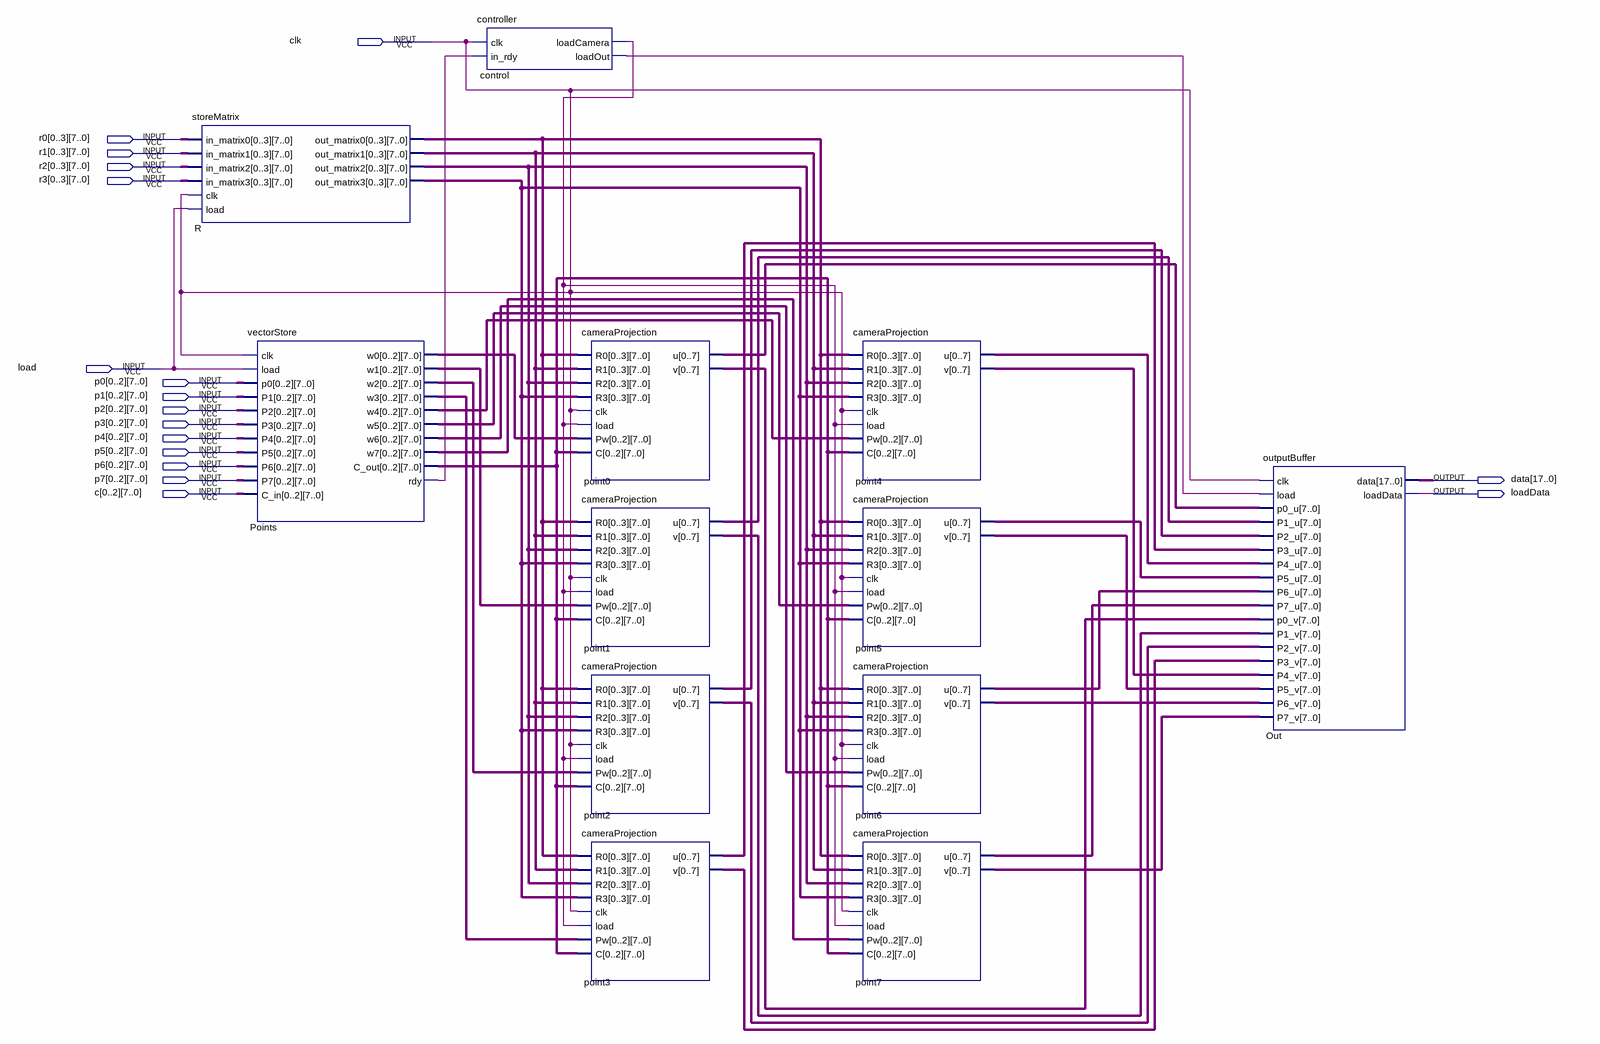
[diagram p0: schematic sheet]
// Quartus schematic projection.bdf as structural Verilog: 12 symbols, 17 pins
module projection (
  input  clk,
  input  [7:0] r0_0,
  input  [7:0] r0_1,
  input  [7:0] r0_2,
  input  [7:0] r0_3,
  input  [7:0] r1_0,
  input  [7:0] r1_1,
  input  [7:0] r1_2,
  input  [7:0] r1_3,
  input  [7:0] r2_0,
  input  [7:0] r2_1,
  input  [7:0] r2_2,
  input  [7:0] r2_3,
  input  [7:0] r3_0,
  input  [7:0] r3_1,
  input  [7:0] r3_2,
  input  [7:0] r3_3,
  input  load,
  input  [7:0] p0_0,
  input  [7:0] p0_1,
  input  [7:0] p0_2,
  input  [7:0] p1_0,
  input  [7:0] p1_1,
  input  [7:0] p1_2,
  input  [7:0] p2_0,
  input  [7:0] p2_1,
  input  [7:0] p2_2,
  input  [7:0] p3_0,
  input  [7:0] p3_1,
  input  [7:0] p3_2,
  input  [7:0] p4_0,
  input  [7:0] p4_1,
  input  [7:0] p4_2,
  input  [7:0] p5_0,
  input  [7:0] p5_1,
  input  [7:0] p5_2,
  input  [7:0] p6_0,
  input  [7:0] p6_1,
  input  [7:0] p6_2,
  input  [7:0] p7_0,
  input  [7:0] p7_1,
  input  [7:0] p7_2,
  input  [7:0] c_0,
  input  [7:0] c_1,
  input  [7:0] c_2,
  output [17:0] data,
  output loadData
);

  wire control_loadcamera, control_loadout, Points_rdy;
  wire [7:0] point0_u, point0_v, point1_u, point1_v, point2_u, point2_v, point3_u, point3_v, point4_u,
       point4_v, point5_u, point5_v, point6_u, point6_v, point7_u, point7_v;
  wire [23:0] Points_c_out, Points_w0, Points_w1, Points_w2, Points_w3, Points_w4, Points_w5, Points_w6,
       Points_w7;
  wire [31:0] R_out_matrix0, R_out_matrix1, R_out_matrix2, R_out_matrix3;

  storeMatrix R (
    .in_matrix0({r0_0, r0_1, r0_2, r0_3}), .in_matrix1({r1_0, r1_1, r1_2, r1_3}),
    .in_matrix2({r2_0, r2_1, r2_2, r2_3}), .in_matrix3({r3_0, r3_1, r3_2, r3_3}), .clk(clk), .load(load),
    .out_matrix0(R_out_matrix0), .out_matrix1(R_out_matrix1), .out_matrix2(R_out_matrix2),
    .out_matrix3(R_out_matrix3));
  vectorStore Points (
    .clk(clk), .load(load), .p0({p0_0, p0_1, p0_2}), .P1({p1_0, p1_1, p1_2}), .P2({p2_0, p2_1, p2_2}),
    .P3({p3_0, p3_1, p3_2}), .P4({p4_0, p4_1, p4_2}), .P5({p5_0, p5_1, p5_2}), .P6({p6_0, p6_1, p6_2}),
    .P7({p7_0, p7_1, p7_2}), .C_in({c_0, c_1, c_2}), .w0(Points_w0), .w1(Points_w1), .w2(Points_w2),
    .w3(Points_w3), .w4(Points_w4), .w5(Points_w5), .w6(Points_w6), .w7(Points_w7), .C_out(Points_c_out),
    .rdy(Points_rdy));
  controller control (.clk(clk), .in_rdy(Points_rdy), .loadCamera(control_loadcamera), .loadOut(control_loadout));
  cameraProjection point0 (
    .R0(R_out_matrix0), .R1(R_out_matrix1), .R2(R_out_matrix2), .R3(R_out_matrix3), .clk(clk),
    .load(control_loadcamera), .Pw(Points_w0), .C(Points_c_out), .u(point0_u), .v(point0_v));
  cameraProjection point1 (
    .R0(R_out_matrix0), .R1(R_out_matrix1), .R2(R_out_matrix2), .R3(R_out_matrix3), .clk(clk),
    .load(control_loadcamera), .Pw(Points_w1), .C(Points_c_out), .u(point1_u), .v(point1_v));
  cameraProjection point2 (
    .R0(R_out_matrix0), .R1(R_out_matrix1), .R2(R_out_matrix2), .R3(R_out_matrix3), .clk(clk),
    .load(control_loadcamera), .Pw(Points_w2), .C(Points_c_out), .u(point2_u), .v(point2_v));
  cameraProjection point3 (
    .R0(R_out_matrix0), .R1(R_out_matrix1), .R2(R_out_matrix2), .R3(R_out_matrix3), .clk(clk),
    .load(control_loadcamera), .Pw(Points_w3), .C(Points_c_out), .u(point3_u), .v(point3_v));
  cameraProjection point4 (
    .R0(R_out_matrix0), .R1(R_out_matrix1), .R2(R_out_matrix2), .R3(R_out_matrix3), .clk(clk),
    .load(control_loadcamera), .Pw(Points_w4), .C(Points_c_out), .u(point4_u), .v(point4_v));
  cameraProjection point5 (
    .R0(R_out_matrix0), .R1(R_out_matrix1), .R2(R_out_matrix2), .R3(R_out_matrix3), .clk(clk),
    .load(control_loadcamera), .Pw(Points_w5), .C(Points_c_out), .u(point5_u), .v(point5_v));
  cameraProjection point6 (
    .R0(R_out_matrix0), .R1(R_out_matrix1), .R2(R_out_matrix2), .R3(R_out_matrix3), .clk(clk),
    .load(control_loadcamera), .Pw(Points_w6), .C(Points_c_out), .u(point6_u), .v(point6_v));
  cameraProjection point7 (
    .R0(R_out_matrix0), .R1(R_out_matrix1), .R2(R_out_matrix2), .R3(R_out_matrix3), .clk(clk),
    .load(control_loadcamera), .Pw(Points_w7), .C(Points_c_out), .u(point7_u), .v(point7_v));
  outputBuffer Out (
    .clk(clk), .load(control_loadout), .p0_u(point0_u), .P1_u(point1_u), .P2_u(point2_u), .P3_u(point3_u),
    .P4_u(point4_u), .P5_u(point5_u), .P6_u(point6_u), .P7_u(point7_u), .p0_v(point0_v), .P1_v(point1_v),
    .P2_v(point2_v), .P3_v(point3_v), .P4_v(point4_v), .P5_v(point5_v), .P6_v(point6_v), .P7_v(point7_v),
    .data(data), .loadData(loadData));
endmodule
